# EAGLE design untitled (EAGLE 9.0.0)
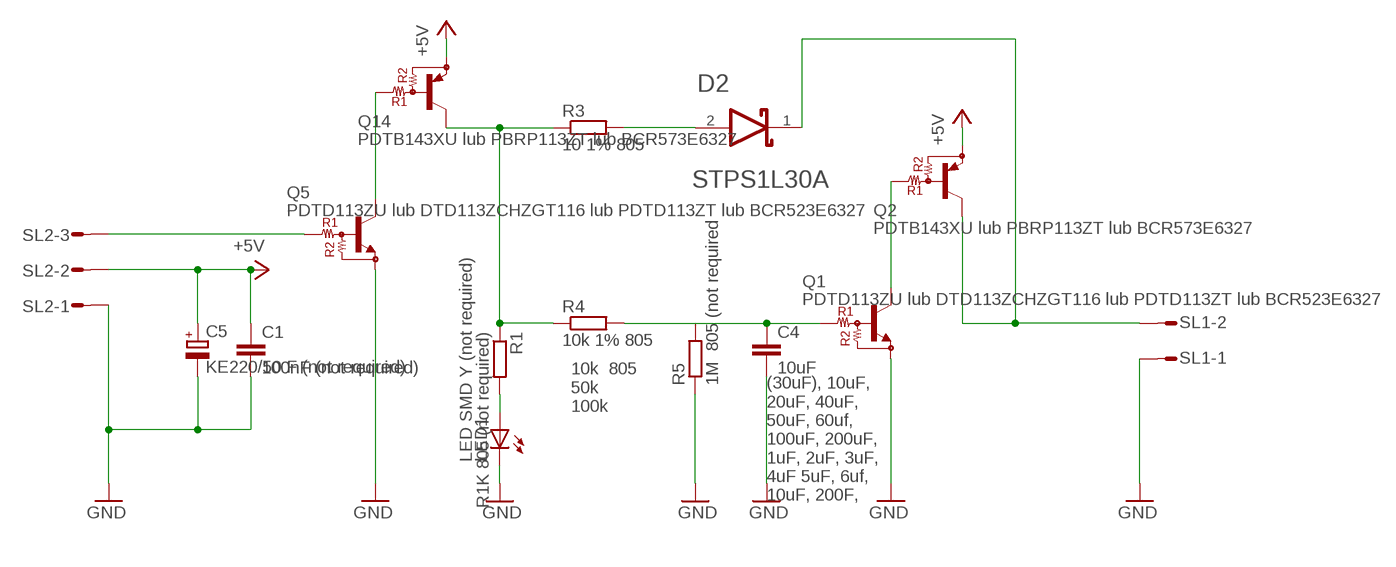
[diagram p0: schematic, sheet 1]

## Parts
C1  100nF (not required)  C-EUC0805  [C0805]
C4  10uF  C-EUC0805  [C0805]
C5  KE220/50 F (not required)  CPOL-EUG  [PANASONIC_G]
D2  MBR0530T1G, STPS1L30A lub STPS1L30U  STMICROELECTRONICS_STPS1L30ASTMICROELECTRONICS_STPS1L30A_0_0  [STMICROELECTRONICS_STPS1L30A_0]
LED1  LED SMD Y (not required)  LEDCHIP-LED0805  [CHIP-LED0805]
Q1  PDTD113ZU lub DTD113ZCHZGT116 lub PDTD113ZT lub BCR523E6327  PDTD113ZU  [SOT-23]
Q2  PDTB143XU lub PBRP113ZT lub BCR573E6327  PDTB143XU  [SOT-23]
Q5  PDTD113ZU lub DTD113ZCHZGT116 lub PDTD113ZT lub BCR523E6327  PDTD113ZU  [SOT-23]
Q14  PDTB143XU lub PBRP113ZT lub BCR573E6327  PDTB143XU  [SOT-23]
R1  R1K 805 (not required)  R-EU_R0805  [R0805]
R3  10 1% 805  R-EU_M0805  [M0805]
R4  10k 1% 805  R-EU_M0805  [M0805]
R5  1M 805 (not required  R-EU_M0805  [M0805]
SL1  M02S  [02P]
SL2  M03S  [03P]

## Nets
+5V: C1.1 C5.+ Q2.2(E) Q14.2(E) SL2.2
GND: C1.2 C4.2 C5.- LED1.C Q1.2(E) Q5.2(E) R5.1 SL1.1 SL2.1
N$1: Q1.3(C) Q2.1(B)
N$2: LED1.A R1.2
N$4: Q14.3(C) R1.1 R3.1 R4.1
N$5: D2.2(ANODE) R3.2
N$6: Q5.1(B) SL2.3
N$7: Q5.3(C) Q14.1(B)
N$8: C4.1 Q1.1(B) R4.2 R5.2
SOFT_START_5.0V: D2.1(CATHODE) Q2.3(C) SL1.2

## Notes on the sheet
- 10k  805
  50k 
  100k
- (30uF), 10uF,
  20uF, 40uF,
  50uF, 60uf,
  100uF, 200uF,
  1uF, 2uF, 3uF,
  4uF 5uF, 6uf,
  10uF, 200F,

## Library data of the parts
C1 C4 = rcl:C-EU: CAPACITOR, European symbol
C5 = rcl:CPOL-EU: POLARIZED CAPACITOR, European symbol
D2 = STMicroelectronics - STPS1L30A:STMICROELECTRONICS_STPS1L30A: LOW DROP POWER SCHOTTKY RECTIFIER; CENTROID_NOT_SPECIFIED: No; DATASHEET: http://www.st.com/content/ccc/resource/technical/document/datasheet/d4/83/f4/ff/dc/cc/48/7f/CD00001323.pdf/files/CD00001323.pdf/jcr:content/translations/en.CD00001323.pdf; DIGIKEY_DESCRIPTION: DIODE SCHOTTKY 30V 1A SMA; DIGIKEY_PART_NUMBER: 497-6577-1-ND; LEAD_FREE: yes; MF: STMicroelectronics; MOUSER_PART_NUMBER: 511-STPS1L30A; MPN: STPS1L30A; PACKAGE: DO-214AC; PREFIX: D; ROHS: yes; TEMPERATURE_RANGE_HIGH: +150°C
LED1 = adafruit:LED: LED OSRAM: - CHIPLED LG R971, LG N971, LY N971, LG Q971, LY Q971, LO R971, LY R971 LH N974, LH R974 LS Q976, LO Q976, LY Q976 LO Q996 - Hyper CHIPLED LW Q18S LB Q993, LB Q99A, LB R99A - SideLED LS A670, LO A670, LY A670, LG A670, LP A670 LB A673, LV A673, LT A673, LW A673 LH A674 LY A675 LS A676, LA A676, LO A676, LY A676, LW A676 LS A679, LY A679, LG A679 - Hyper Micro SIDELED® LS Y876, LA Y876, LO Y876, LY Y876 LT Y87S - SmartLED LW L88C, LW L88S LB L89C, LB L89S, LG L890 LS L89K, LO L89K, LY L89K LS L896, LA L896, LO L896, LY L896 - TOPLED LS T670, LO T670, LY T670, LG T670, LP T670 LSG T670, LSP T670, LSY T670, LOP T670, LYG T670 LG T671, LOG T671, LSG T671 LB T673, LV T673, LT T673, LW T673 LH T674 LS T676, LA T676, LO T676, LY T676, LB T676, LH T676, LSB T676, LW T676 LB T67C, LV T67C, LT T67C, LS T67K, LO T67K, LY T67K, LW E67C LS E67B, LA E67B, LO E67B, LY E67B, LB E67C, LV E67C, LT E67C LW T67C LS T679, LY T679, LG T679 LS T770, LO T770, LY T770, LG T770, LP T770 LB T773, LV T773, LT T773, LW T773 LH T774 LS E675, LA E675, LY E675, LS T675 LS T776, LA T776, LO T776, LY T776, LB T776 LHGB T686 LT T68C, LB T68C - Hyper Mini TOPLED® LB M676 - Mini TOPLED Santana® LG M470 LS M47K, LO M47K, LY M47K Source: http://www.osram.convergy.de/
Q1 Q5 = pre-bias-transistor:PDTD: Pre biase NPN transistor NPN Resistor-Equipped Transistor (RET) family in a very small SOT323 (SC-70) Surface-Mounted Device (SMD) plastic package. VCC = 50V Ic (max) = 500 mA; R1: 1 kOhm; R2: 10 kOhm
Q2 Q14 = pre-bias-transistor:PDTB: PNP Resistor-Equipped Transistor (RET) family in a very small SOT323 (SC-70) Surface-Mounted Device (SMD) plastic package. VCC = -50 IC (max) = -500mA; R1: 4.7 kOhm; R2: 10 kOhm
R1 R3-R5 = rcl:R-EU_: RESISTOR, European symbol
SL1 = con-amp-quick:M02S: AMP QUICK CONNECTOR; OC_FARNELL: unknown; OC_NEWARK: unknown
SL2 = con-amp-quick:M03S: AMP QUICK CONNECTOR; OC_FARNELL: unknown; OC_NEWARK: unknown

## Board
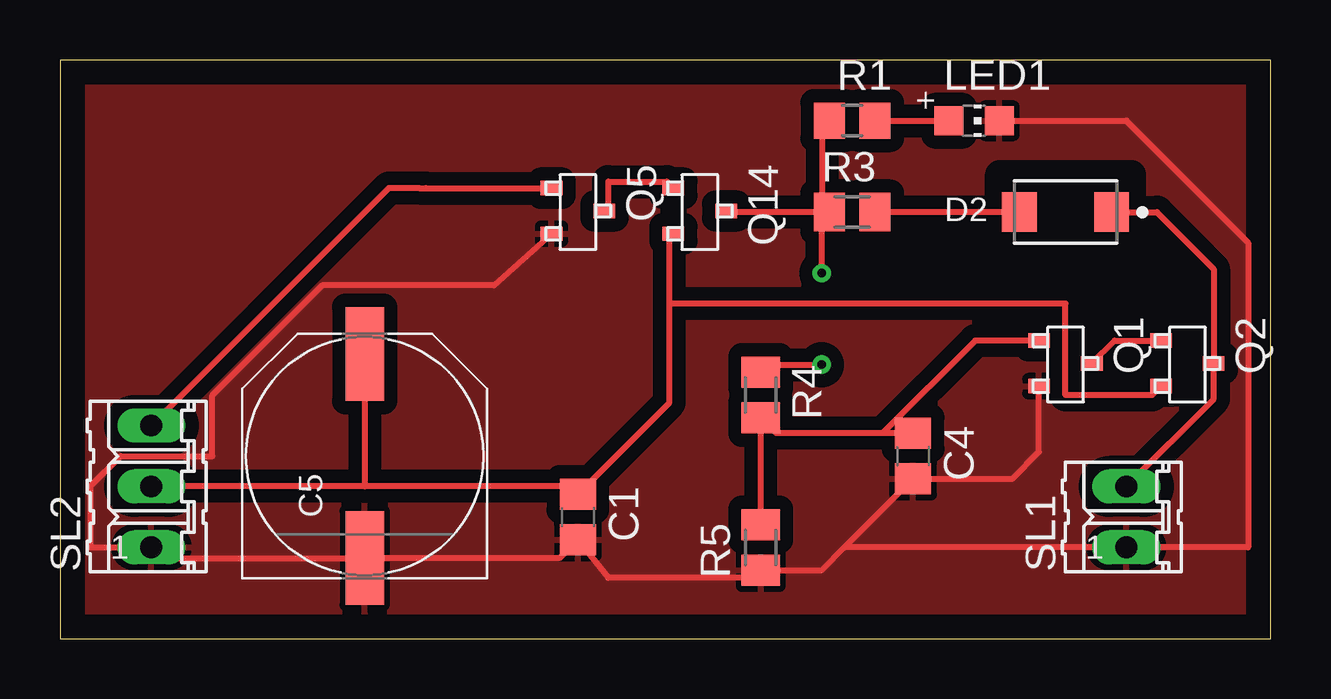
[diagram p1: board, top side]
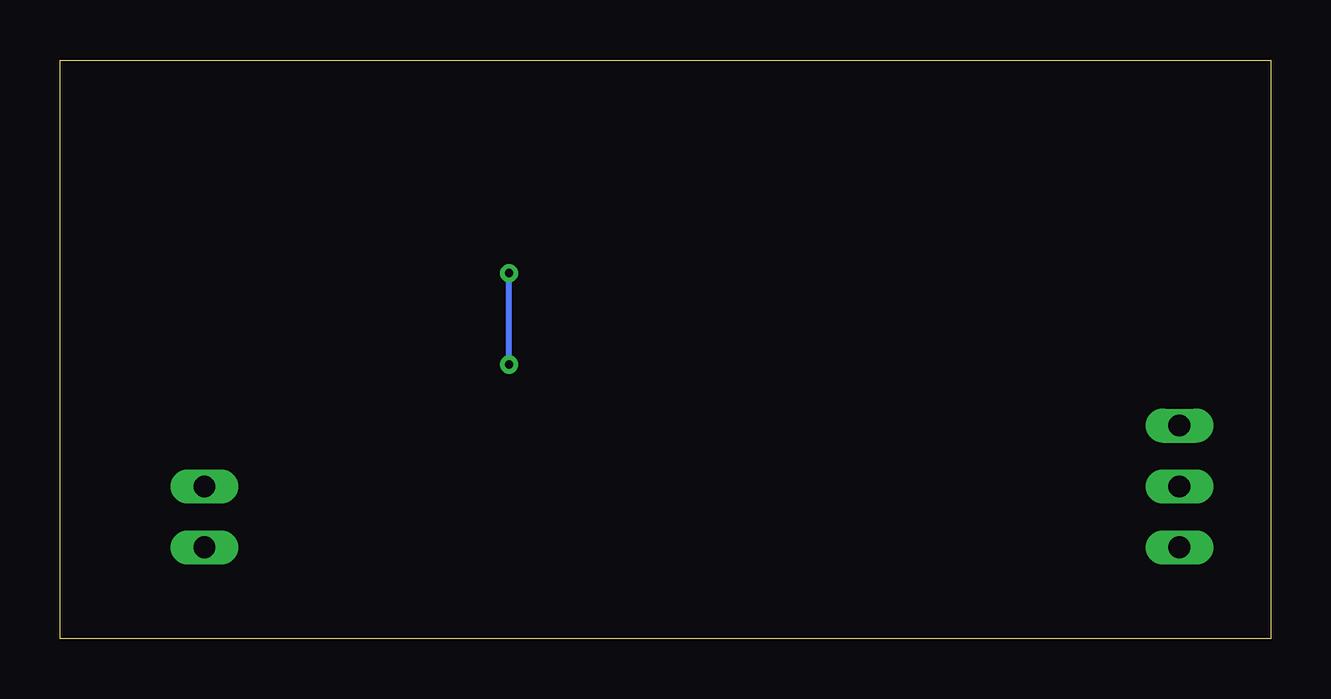
[diagram p2: board, bottom side, seen from below]

Size 50.47 x 24.12 mm. Coordinates in mm from the lower left corner, seen from the top.
Outline: 0,0 50.47,0 50.47,24.12 0,24.12 0,0
Copper layers (1*16): Top 0.035mm / dielectric 1.5mm / Bottom 0.035mm
Design rules "default": minimum track width 6mil, minimum drill 0.35mm, track to track 6mil, track to pad 6mil, pad to pad 6mil, via to via 6mil, smd to smd 6mil, copper to edge 40mil, drill to drill 6mil, minimum pad ring 10mil, minimum via ring 8mil, stop-mask expansion 4mil, vias tented up to drill 0mil, thermal gap 10mil

### Footprints (pad centres in the part's own frame; a part is rotated, then mirrored left to right if it is on the bottom)
C0805 = smd 1.3 x 1.5: 1 -0.95,0; 2 0.95,0
PANASONIC_G = smd 3.9 x 1.6: + 4.25,0; - -4.25,0
STMICROELECTRONICS_STPS1L30A_0 = smd 1.45 x 1.65: 1 -1.925,0; 2 1.925,0
CHIP-LED0805 = smd 1.2 x 1.2: A 0,-1.05; C 0,1.05
SOT-23 = smd 0.6 x 0.9: 1 -1,-1.1; 2 0.9,-1.1; 3 -0.05,1.1
R0805 = smd 1.3 x 1.5: 1 -0.95,0; 2 0.95,0
M0805 = smd 1.3 x 1.6: 1 -0.95,0; 2 0.95,0
02P = drill 0.914 long: 1 -1.27,0; 2 1.27,0
03P = drill 0.914 long: 1 -2.54,0; 2 0,0; 3 2.54,0

### Placement (x,y rotation side)
C1  21.59,5.08 270 top
C4  35.56,7.62 270 top
C5  12.7,7.62 90 top
D2  41.91,17.78 180 top
LED1  38.1,21.59 270 top
Q1  41.91,11.43 270 top
Q2  46.99,11.43 270 top
Q5  21.59,17.78 270 top
Q14  26.67,17.78 270 top
R1  33.02,21.59 0 top
R3  33.02,17.78 0 top
R4  29.21,10.16 270 top
R5  29.21,3.81 90 top
SL1  44.45,5.08 90 top
SL2  3.81,6.35 90 top

### Tracks (layer width: path | path; a pad name or v marks a point on that pad's centre or on a via)
+5V
  Top 0.254: 12.7,10.16 C5.+ 12.7,6.35 | 12.7,6.35 21.27,6.35 C1.1 25.4,9.84 25.4,13.97 | 12.7,6.35 SL2.2 | Q2.2 45.52,10.16 41.91,10.16 41.91,13.97 25.4,13.97 | 25.4,13.97 25.4,16.71 Q14.2
GND
  Top 0.254: 32.7,3.81 C4.2 39.69,6.67 40.81,7.79 Q1.2 | 32.7,3.81 SL1.1 49.53,3.81 49.53,16.51 44.45,21.59 LED1.C | 32.7,3.81 31.75,2.86 R5.1 28.89,2.54 22.86,2.54 C1.2 20.83,3.37 C5.- 4.25,3.37 SL2.1 1.27,3.81 1.27,6.35 2.54,7.62 6.35,7.62 6.35,10.16 10.92,14.73 18.09,14.73 Q5.2
  pour Top (isolate 0.559): -1.27,12.7 -1.27,25.4 52.07,25.4 52.07,-1.27 -1.27,-1.27
N$1
  Top 0.254: Q1.3 43.96,12.43 Q2.1
N$2
  Top 0.254: R1.2 LED1.A
N$4  (via drill 0.35)
  Top 0.254: R3.1 31.75,17.78 | 31.75,17.78 27.82,17.78 Q14.3 | R1.1 31.75,21.27 31.75,17.78 | R4.1 29.53,11.43 v31.75,11.43 | v31.75,15.24 31.75,17.78
  Bottom 0.254: v31.75,11.43 v31.75,15.24
N$5
  Top 0.254: D2.2 R3.2
N$6
  Top 0.254: Q5.1 15.24,18.78 14.97,18.78 13.7,18.78 SL2.3
N$7
  Top 0.254: Q5.3 22.86,18 22.86,19.05 25.3,19.05 Q14.1
N$8
  Top 0.254: C4.1 34.29,8.57 | 34.29,8.57 29.85,8.57 R4.2 R5.2 | Q1.1 38.15,12.43 34.29,8.57
SOFT_START_5.0V
  Top 0.254: SL1.2 48.09,9.99 Q2.3 48.09,15.41 45.72,17.78 D2.1